# EAGLE schematic WiazkaSwiatlaTyl (EAGLE 7.7.0)
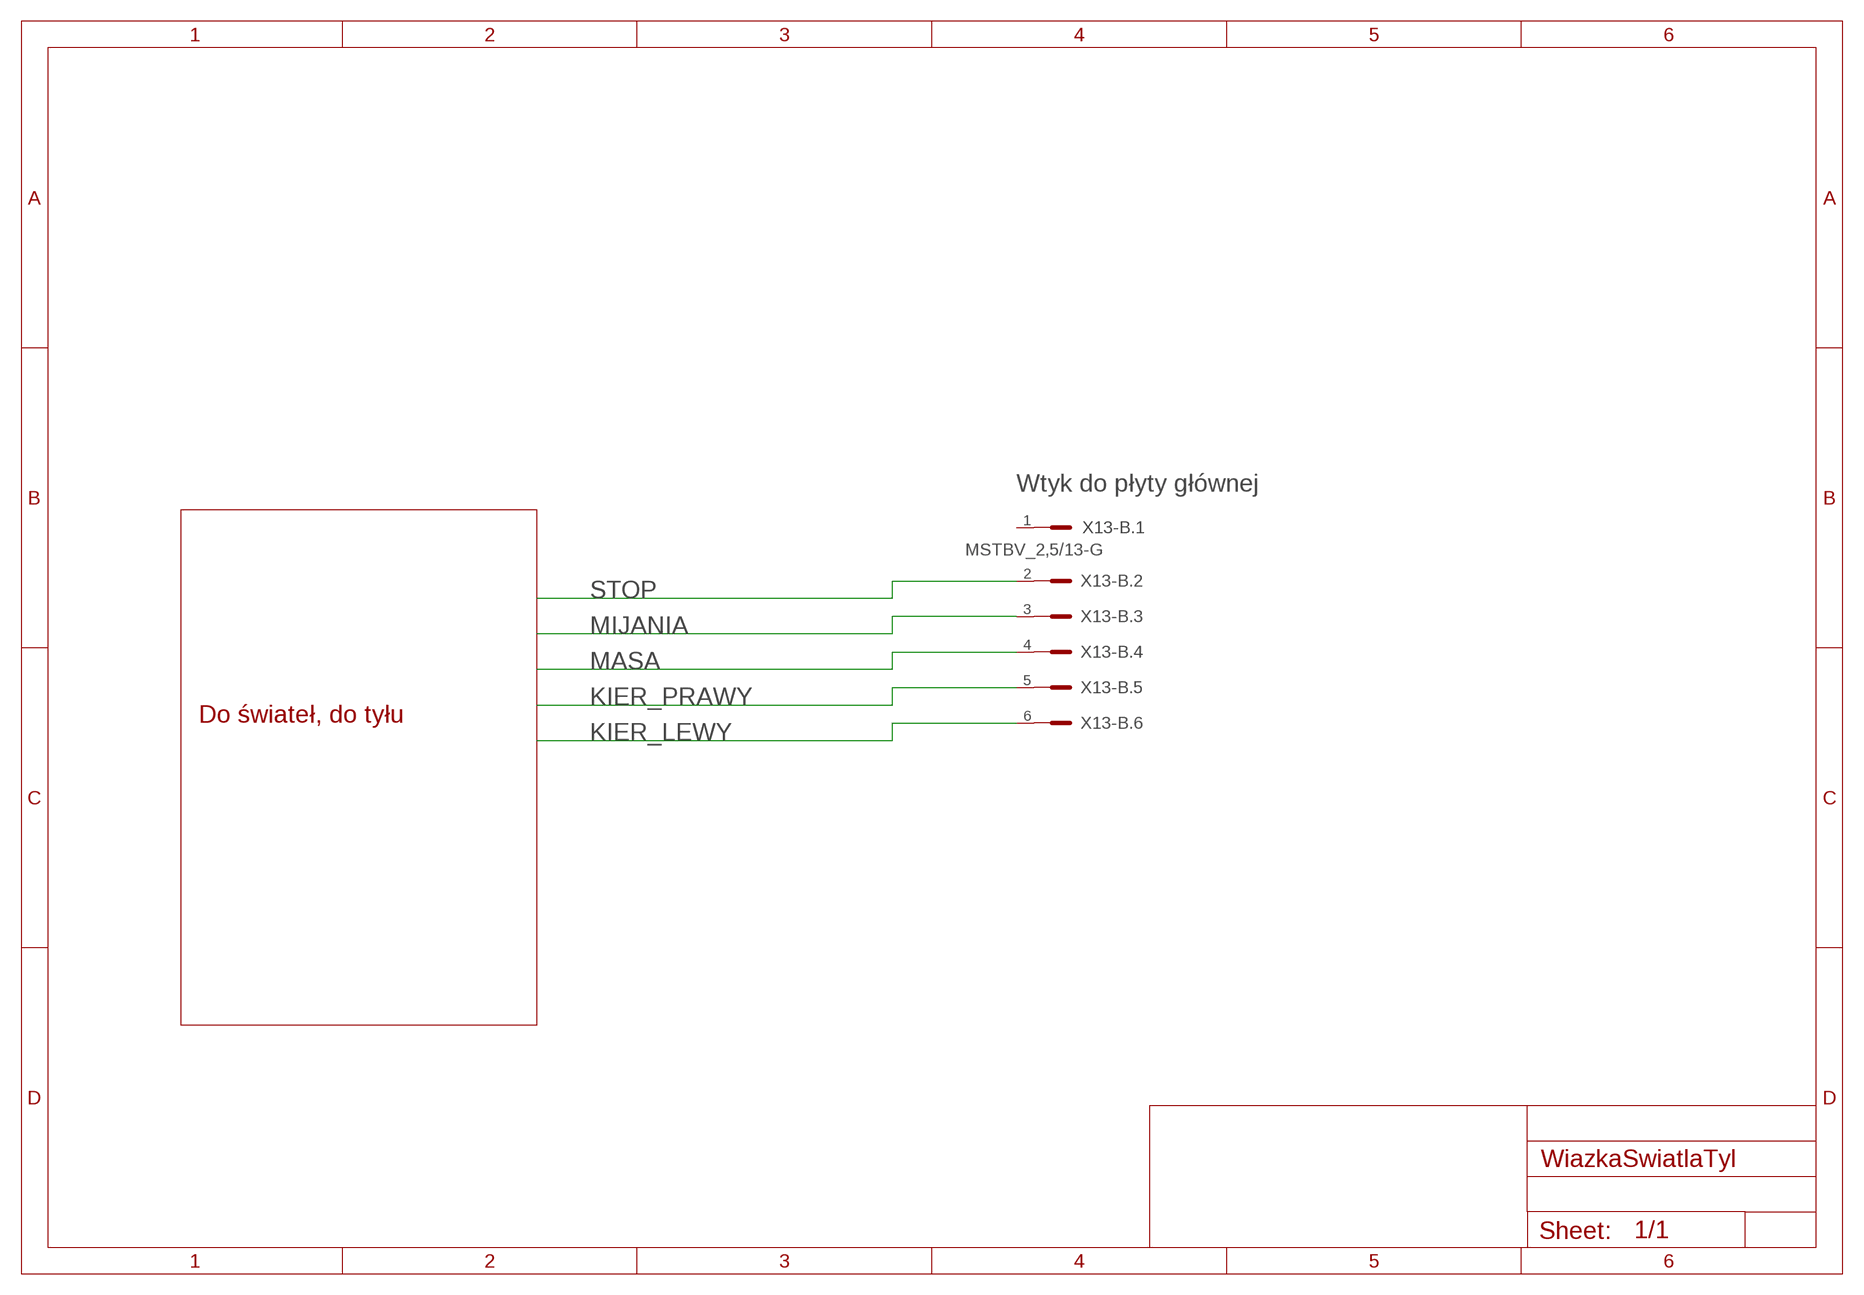
[diagram p0: schematic, sheet 1]

## Parts
X13-B  MSTBV_2,5/13-G  [MSTBV_2,5/13-G]

## Nets
KIER_LEWY: X13-B.6
KIER_PRAWY: X13-B.5
MASA: X13-B.4
MIJANIA: X13-B.3
STOP: X13-B.2
Unconnected: X13-B.1 X13-B.7 X13-B.8 X13-B.9 X13-B.10 X13-B.11 X13-B.12 X13-B.13

## Notes on the sheet
- Wtyk do płyty głównej
- Do świateł, do tyłu

## Library data of the parts
X13-B = con-phoenix-500:MSTBV_2,5/13-G: Grundleiste - MSTBV 2,5/13-G - 1753657 Grundgehäuse, Nennstrom: 12 A Bemessungsspannung (III/2): 320 V Polzahl: 13 Rastermaß: 5 mm Farbe: grün Kontaktoberfläche: Zinn Montage: Löten